# Altium schematic sheet Top.SchDoc
size A4; Organization: TESLA Motors, INC; Address1: 3500 Deer Creek Road; Address2: Palo Alto, CA; Address4: U.S.A.; SheetNumber: 1; SheetTotal: 1
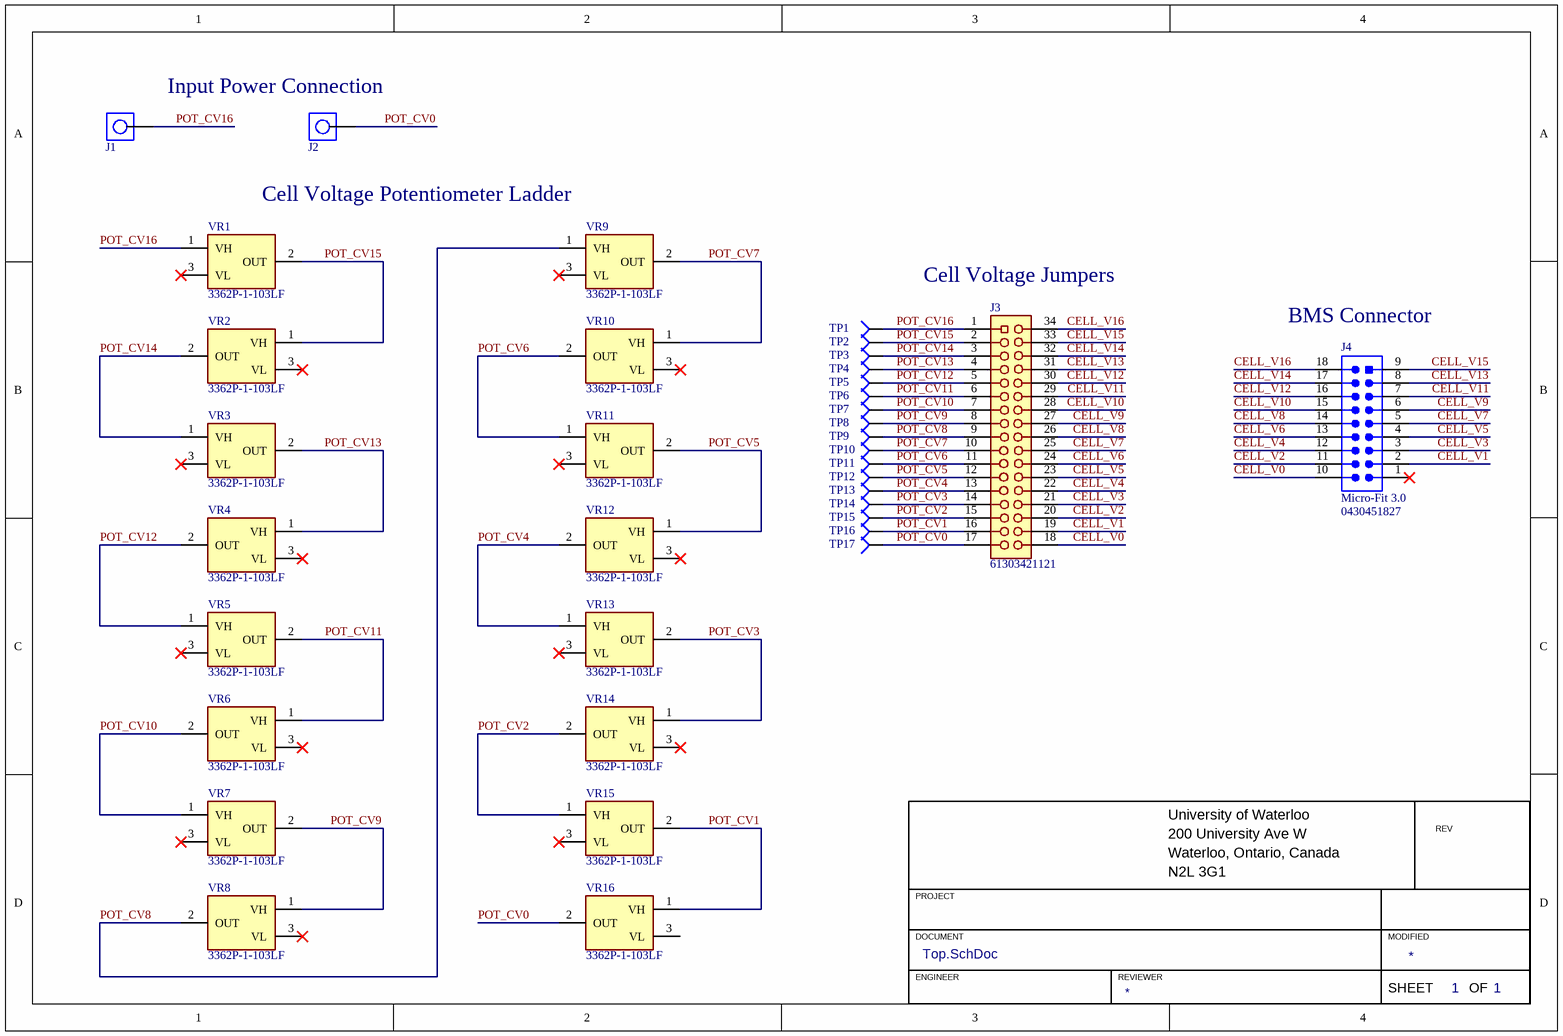
[diagram p0: Top.SchDoc]

## Parts
J1  105-1102-001  [CINCH_BANANA_JACK_RED]  (value not drawn)
J2  105-1103-001  [CINCH_BANANA_JACK_RED]  (value not drawn)
J3  Manufacturer Part Number 1: 61303421121  [HEADER_2x17]  (hidden comment: HEADER 17X2)
J4  Family: Micro-Fit 3.0  [MOLEX-0430451827]  (hidden comment: 0430451827)
TP1  TESTPOINT_1MM_SQUARE  [TESTPOINT_SQUARE_1MM]  (value not drawn)  (no BOM)
TP2  TESTPOINT_1MM_SQUARE  [TESTPOINT_SQUARE_1MM]  (value not drawn)  (no BOM)
TP3  TESTPOINT_1MM_SQUARE  [TESTPOINT_SQUARE_1MM]  (value not drawn)  (no BOM)
TP4  TESTPOINT_1MM_SQUARE  [TESTPOINT_SQUARE_1MM]  (value not drawn)  (no BOM)
TP5  TESTPOINT_1MM_SQUARE  [TESTPOINT_SQUARE_1MM]  (value not drawn)  (no BOM)
TP6  TESTPOINT_1MM_SQUARE  [TESTPOINT_SQUARE_1MM]  (value not drawn)  (no BOM)
TP7  TESTPOINT_1MM_SQUARE  [TESTPOINT_SQUARE_1MM]  (value not drawn)  (no BOM)
TP8  TESTPOINT_1MM_SQUARE  [TESTPOINT_SQUARE_1MM]  (value not drawn)  (no BOM)
TP9  TESTPOINT_1MM_SQUARE  [TESTPOINT_SQUARE_1MM]  (value not drawn)  (no BOM)
TP10  TESTPOINT_1MM_SQUARE  [TESTPOINT_SQUARE_1MM]  (value not drawn)  (no BOM)
TP11  TESTPOINT_1MM_SQUARE  [TESTPOINT_SQUARE_1MM]  (value not drawn)  (no BOM)
TP12  TESTPOINT_1MM_SQUARE  [TESTPOINT_SQUARE_1MM]  (value not drawn)  (no BOM)
TP13  TESTPOINT_1MM_SQUARE  [TESTPOINT_SQUARE_1MM]  (value not drawn)  (no BOM)
TP14  TESTPOINT_1MM_SQUARE  [TESTPOINT_SQUARE_1MM]  (value not drawn)  (no BOM)
TP15  TESTPOINT_1MM_SQUARE  [TESTPOINT_SQUARE_1MM]  (value not drawn)  (no BOM)
TP16  TESTPOINT_1MM_SQUARE  [TESTPOINT_SQUARE_1MM]  (value not drawn)  (no BOM)
TP17  TESTPOINT_1MM_SQUARE  [TESTPOINT_SQUARE_1MM]  (value not drawn)  (no BOM)
VR1  Manufacturer Part Number 1: 3362P-1-103LF  [TRIMPOT_3362]  (hidden comment: POT_10K_TRIM)
VR2  Manufacturer Part Number 1: 3362P-1-103LF  [TRIMPOT_3362]  (hidden comment: POT_10K_TRIM)
VR3  Manufacturer Part Number 1: 3362P-1-103LF  [TRIMPOT_3362]  (hidden comment: POT_10K_TRIM)
VR4  Manufacturer Part Number 1: 3362P-1-103LF  [TRIMPOT_3362]  (hidden comment: POT_10K_TRIM)
VR5  Manufacturer Part Number 1: 3362P-1-103LF  [TRIMPOT_3362]  (hidden comment: POT_10K_TRIM)
VR6  Manufacturer Part Number 1: 3362P-1-103LF  [TRIMPOT_3362]  (hidden comment: POT_10K_TRIM)
VR7  Manufacturer Part Number 1: 3362P-1-103LF  [TRIMPOT_3362]  (hidden comment: POT_10K_TRIM)
VR8  Manufacturer Part Number 1: 3362P-1-103LF  [TRIMPOT_3362]  (hidden comment: POT_10K_TRIM)
VR9  Manufacturer Part Number 1: 3362P-1-103LF  [TRIMPOT_3362]  (hidden comment: POT_10K_TRIM)
VR10  Manufacturer Part Number 1: 3362P-1-103LF  [TRIMPOT_3362]  (hidden comment: POT_10K_TRIM)
VR11  Manufacturer Part Number 1: 3362P-1-103LF  [TRIMPOT_3362]  (hidden comment: POT_10K_TRIM)
VR12  Manufacturer Part Number 1: 3362P-1-103LF  [TRIMPOT_3362]  (hidden comment: POT_10K_TRIM)
VR13  Manufacturer Part Number 1: 3362P-1-103LF  [TRIMPOT_3362]  (hidden comment: POT_10K_TRIM)
VR14  Manufacturer Part Number 1: 3362P-1-103LF  [TRIMPOT_3362]  (hidden comment: POT_10K_TRIM)
VR15  Manufacturer Part Number 1: 3362P-1-103LF  [TRIMPOT_3362]  (hidden comment: POT_10K_TRIM)
VR16  Manufacturer Part Number 1: 3362P-1-103LF  [TRIMPOT_3362]  (hidden comment: POT_10K_TRIM)

## Nets
CELL_V0: J3.18 J4.10
CELL_V1: J3.19 J4.2
CELL_V2: J3.20 J4.11
CELL_V3: J3.21 J4.3
CELL_V4: J3.22 J4.12
CELL_V5: J3.23 J4.4
CELL_V6: J3.24 J4.13
CELL_V7: J3.25 J4.5
CELL_V8: J3.26 J4.14
CELL_V9: J3.27 J4.6
CELL_V10: J3.28 J4.15
CELL_V11: J3.29 J4.7
CELL_V12: J3.30 J4.16
CELL_V13: J3.31 J4.8
CELL_V14: J3.32 J4.17
CELL_V15: J3.33 J4.9
CELL_V16: J3.34 J4.18
POT_CV0: J2.1 J3.17 TP17.1(=value) VR16.2(OUT)
POT_CV1: J3.16 TP16.1(=value) VR15.2(OUT) VR16.1(VH)
POT_CV2: J3.15 TP15.1(=value) VR14.2(OUT) VR15.1(VH)
POT_CV3: J3.14 TP14.1(=value) VR13.2(OUT) VR14.1(VH)
POT_CV4: J3.13 TP13.1(=value) VR12.2(OUT) VR13.1(VH)
POT_CV5: J3.12 TP12.1(=value) VR11.2(OUT) VR12.1(VH)
POT_CV6: J3.11 TP11.1(=value) VR10.2(OUT) VR11.1(VH)
POT_CV7: J3.10 TP10.1(=value) VR9.2(OUT) VR10.1(VH)
POT_CV8: J3.9 TP9.1(=value) VR8.2(OUT) VR9.1(VH)
POT_CV9: J3.8 TP8.1(=value) VR7.2(OUT) VR8.1(VH)
POT_CV10: J3.7 TP7.1(=value) VR6.2(OUT) VR7.1(VH)
POT_CV11: J3.6 TP6.1(=value) VR5.2(OUT) VR6.1(VH)
POT_CV12: J3.5 TP5.1(=value) VR4.2(OUT) VR5.1(VH)
POT_CV13: J3.4 TP4.1(=value) VR3.2(OUT) VR4.1(VH)
POT_CV14: J3.3 TP3.1(=value) VR2.2(OUT) VR3.1(VH)
POT_CV15: J3.2 TP2.1(=value) VR1.2(OUT) VR2.1(VH)
POT_CV16: J1.1 J3.1(VCC) TP1.1(=value) VR1.1(VH)

Not connected (* = marked no-connect by the designer): J4 1*; VR1 3(VL)*; VR2 3(VL)*; VR3 3(VL)*; VR4 3(VL)*; VR5 3(VL)*; VR6 3(VL)*; VR7 3(VL)*; VR8 3(VL)*; VR9 3(VL)*; VR10 3(VL)*; VR11 3(VL)*; VR12 3(VL)*; VR13 3(VL)*; VR14 3(VL)*; VR15 3(VL)*; VR16 3(VL)

## Notes on the sheet
- (near J2) Input Power Connection
- Cell Voltage Potentiometer Ladder
- (near J3) Cell Voltage Jumpers
- (near J4) BMS Connector
- University of Waterloo
- 200 University Ave W
- REV
- PROJECT
- Waterloo, Ontario, Canada
- N2L 3G1
- DOCUMENT
- ENGINEER
- REVIEWER
- MODIFIED
- SHEET
- OF

## Library data of the parts
J1 = CON_BANANA_RED_5A: CONN TIP JACK SOLDER RED; Manufacturer 1: Cinch Connectivity Solutions Johnson; Current Rating: 5A; Supplier 1: Digi-Key; Supplier Part Number 1: J576-ND; Manufacturer Part Number 1: 105-1102-001
J2 = CON_BANANA_BLACK_5A: CONN TIP JACK SOLDER BLACK; Manufacturer 1: Cinch Connectivity Solutions Johnson; Current Rating: 5A; Manufacturer Part Number 1: 105-1103-001; Supplier 1: Digi-Key; Supplier Part Number 1: J577-ND
J3 = HEADER 17X2: CONN HEADER VERT 34POS 2.54MM; Manufacturer 1: Würth Elektronik; Supplier Part Number 1: 732-5308-ND; Supplier 1: Digi-Key
J4 = CON_MOLEX-HDR_9x2_TH: CONN HEADER VERT 18POS 3MM; Manufacturer 1: Molex; Voltage Rating: 250VAC; Current Rating: 5A; Pitch: 3mm; Supplier 1: Digi-Key; Supplier Part Number 1: WM10723-ND; Manufacturer Part Number 1: 0430451827
TP1-TP17 = TESTPOINT_1MM_SQUARE: TESTPOINT 1MM SQUARE
VR1-VR16 = POT_10K_TRIM: TRIMMER 10K OHM 0.5W PC PIN TOP; Manufacturer 1: Bourns Inc.; Resistance: 10kΩ; Supplier 1: Digi-Key; Supplier Part Number 1: 3362P-103LF-ND